# EAGLE design TFT Touch (EAGLE 5.11)
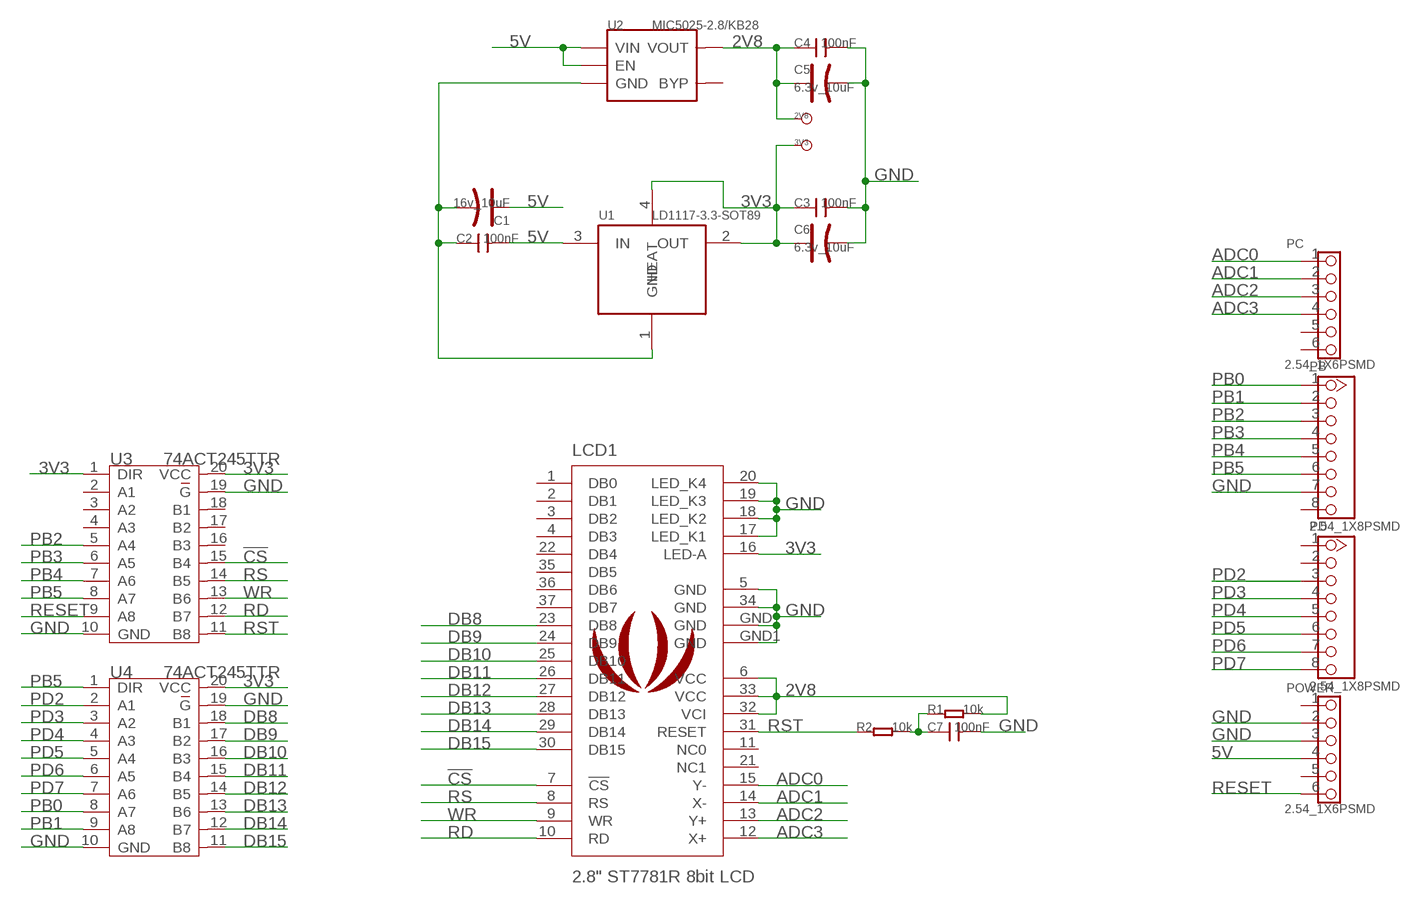
[diagram p0: schematic, sheet 1]

## Parts
2V8  TEST_POINT_SIZE_3030  [TP_3535]
3V3  TEST_POINT_SIZE_3030  [TP_3535]
C1  16v_10uF  006-CAP_AVX_A  [AVX_A]
C2  100nF  006-C35*40  [0603]
C3  100nF  006-C35*40  [0603]
C4  100nF  006-C35*40  [0603]
C5  6.3v_10uF  006-CAP_AVX_A  [AVX_A]
C6  6.3v_10uF  006-CAP_AVX_A  [AVX_A]
C7  100nF  006-C35*40  [0603]
LCD1  2.8" ST7781R 8bit LCD  TFT2.8  [TFT2.8]
LOGO1  LOGO_SILK  [LOGO_SILK]
PB  2.54_1X8PSMD  [SMD_8PIN_2.54]
PC  2.54_1X6PSMD  6PSMD  [2.54_6P_SMD]
PD  2.54_1X8PSMD  [SMD_8PIN_2.54]
POWER  2.54_1X6PSMD  6PSMD  [2.54_6P_SMD]
R1  10k  005-R0603  [0603-1]
R2  10k  005-R0603  [0603-1]
U1  LD1117-3.3-SOT89  LD1117SOT89  [SOT89]
U2  MIC5025-2.8/KB28  MIC5205  [SOT23-5]
U3  74ACT245TTR  74ACT245  [TSSOP20]
U4  74ACT245TTR  74ACT245  [TSSOP20]

## Nets
2V8: 2V8.T C4.1 C5.+ LCD1.6(VCC) LCD1.32(VCI) LCD1.33(VCC) R1.2 U2.5(VOUT)
3V3: 3V3.T C3.1 C6.+ LCD1.16(LED-A) U1.2(OUT) U1.4(HEAT) U3.1(DIR) U3.20(VCC) U4.20(VCC)
5V: C1.+ C2.2 POWER.4 U1.3(IN) U2.1(VIN) U2.3(EN)
!CS: LCD1.7(!CS) U3.15(B4)
ADC0: LCD1.15(Y-) PC.1
ADC1: LCD1.14(X-) PC.2
ADC2: LCD1.13(Y+) PC.3
ADC3: LCD1.12(X+) PC.4
DB8: LCD1.23(DB8) U4.18(B1)
DB9: LCD1.24(DB9) U4.17(B2)
DB10: LCD1.25(DB10) U4.16(B3)
DB11: LCD1.26(DB11) U4.15(B4)
DB12: LCD1.27(DB12) U4.14(B5)
DB13: LCD1.28(DB13) U4.13(B6)
DB14: LCD1.29(DB14) U4.12(B7)
DB15: LCD1.30(DB15) U4.11(B8)
GND: C1.- C2.1 C3.2 C4.2 C5.- C6.- C7.2 LCD1.5(GND) LCD1.17(LED_K1) LCD1.18(LED_K2) LCD1.19(LED_K3) LCD1.20(LED_K4) LCD1.34(GND) LCD1.GND LCD1.GND1(GND) PB.7 POWER.2 POWER.3 U1.1(GND) U2.2(GND) U3.10(GND) U3.19(G) U4.10(GND) U4.19(G)
N$1: C7.1 R1.1 R2.2
PB0: PB.1 U4.8(A7)
PB1: PB.2 U4.9(A8)
PB2: PB.3 U3.5(A4)
PB3: PB.4 U3.6(A5)
PB4: PB.5 U3.7(A6)
PB5: PB.6 U3.8(A7) U4.1(DIR)
PD2: PD.3 U4.2(A1)
PD3: PD.4 U4.3(A2)
PD4: PD.5 U4.4(A3)
PD5: PD.6 U4.5(A4)
PD6: PD.7 U4.6(A5)
PD7: PD.8 U4.7(A6)
RD: LCD1.10(RD) U3.12(B7)
RESET: POWER.6 U3.9(A8)
RS: LCD1.8(RS) U3.14(B5)
RST: LCD1.31(RESET) R2.1 U3.11(B8)
WR: LCD1.9(WR) U3.13(B6)
Unconnected: LCD1.1(DB0) LCD1.2(DB1) LCD1.3(DB2) LCD1.4(DB3) LCD1.11(NC0) LCD1.21(NC1) LCD1.22(DB4) LCD1.35(DB5) LCD1.36(DB6) LCD1.37(DB7) PB.8 PC.5 PC.6 PD.1 PD.2 POWER.1 POWER.5 U2.4(BYP) U3.2(A1) U3.3(A2) U3.4(A3) U3.16(B3) U3.17(B2) U3.18(B1)

## Library data of the parts
2V8 3V3 = For_Test_Albert:TEST_POINT
C1 C5 C6 = Discrete:006-CAP*: Electrolytic Capacitors,Tantalum Capacitors and Super Capacitors
C2-C4 C7 = Discrete:006-C*: Ceramic Capacitors
LCD1 = EXT_moudle:TFT2.8
LOGO1 = logo:LOGO_SILK
PB PD = Connector:2.54_1X8P
PC POWER = Connector:6P
R1 R2 = Discrete:005-R*
U1 = ICs_v54:LD1117
U2 = IC:MIC5205: The MIC5205 is an efficient linear voltage regulator with ultra-low-noise output, very low dropout voltage (typically 17mV at light loads and 165mV at 150mA), and very low ground current (600µA at 100mA output). The MIC5205 offers better than 1% initial accuracy. datasheet here: http://www.micrel.com/product-info/prod/5205.shtml
U3 U4 = IC:74ACT245

## Net classes
0 default: width 0.203 mm, drill 0.305 mm, clearance 0.152 mm

## Board
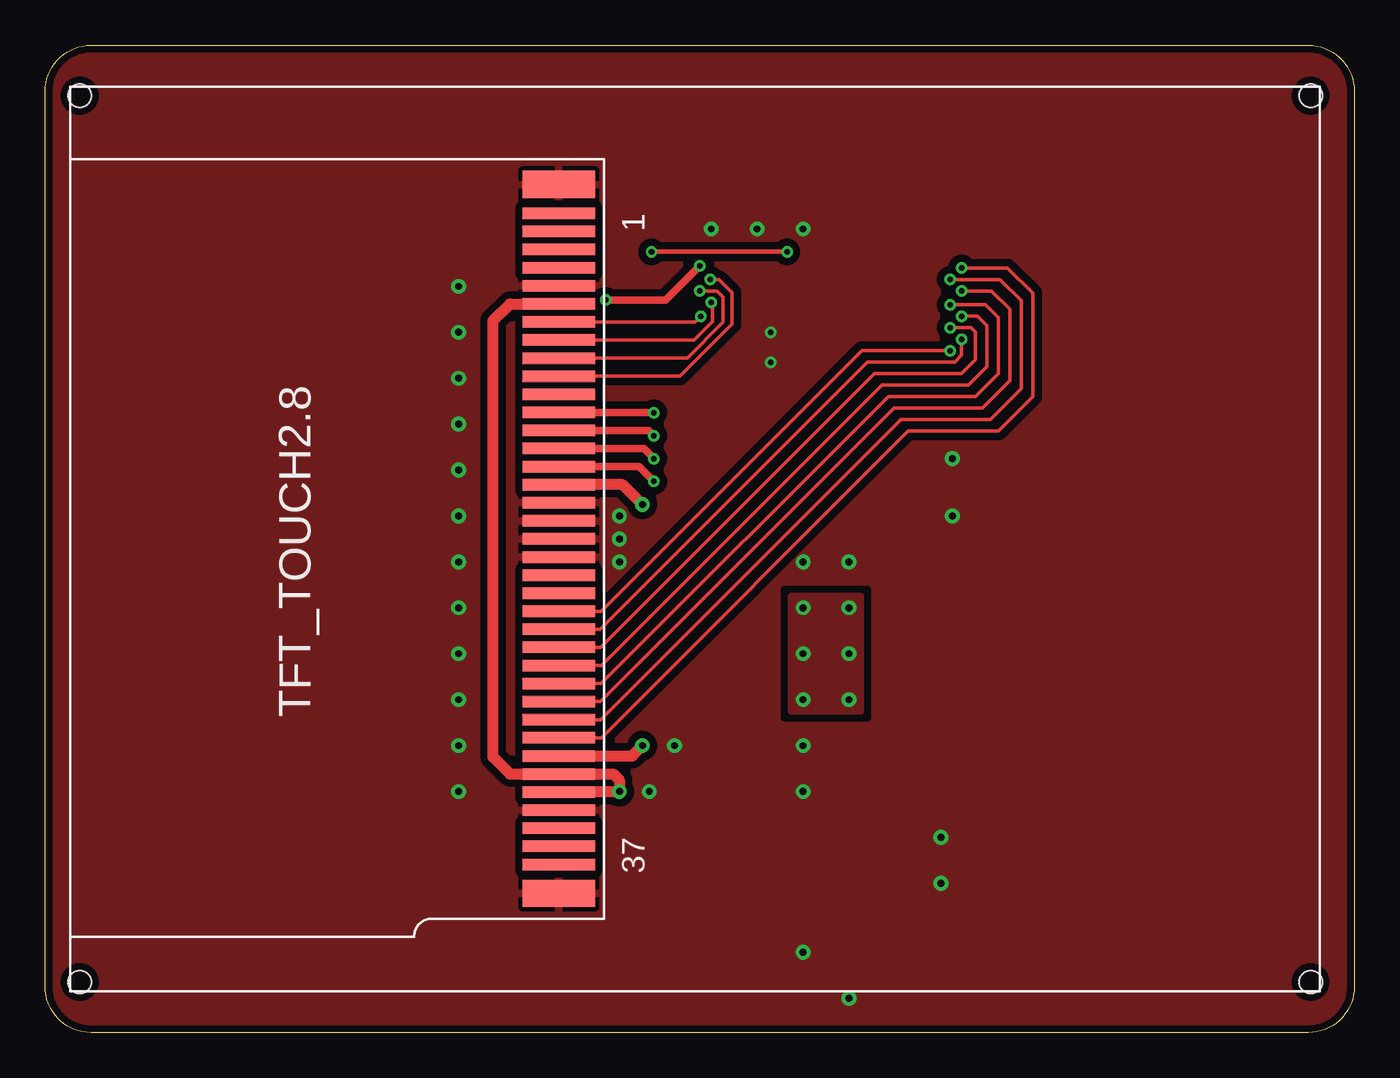
[diagram p1: board, top side]
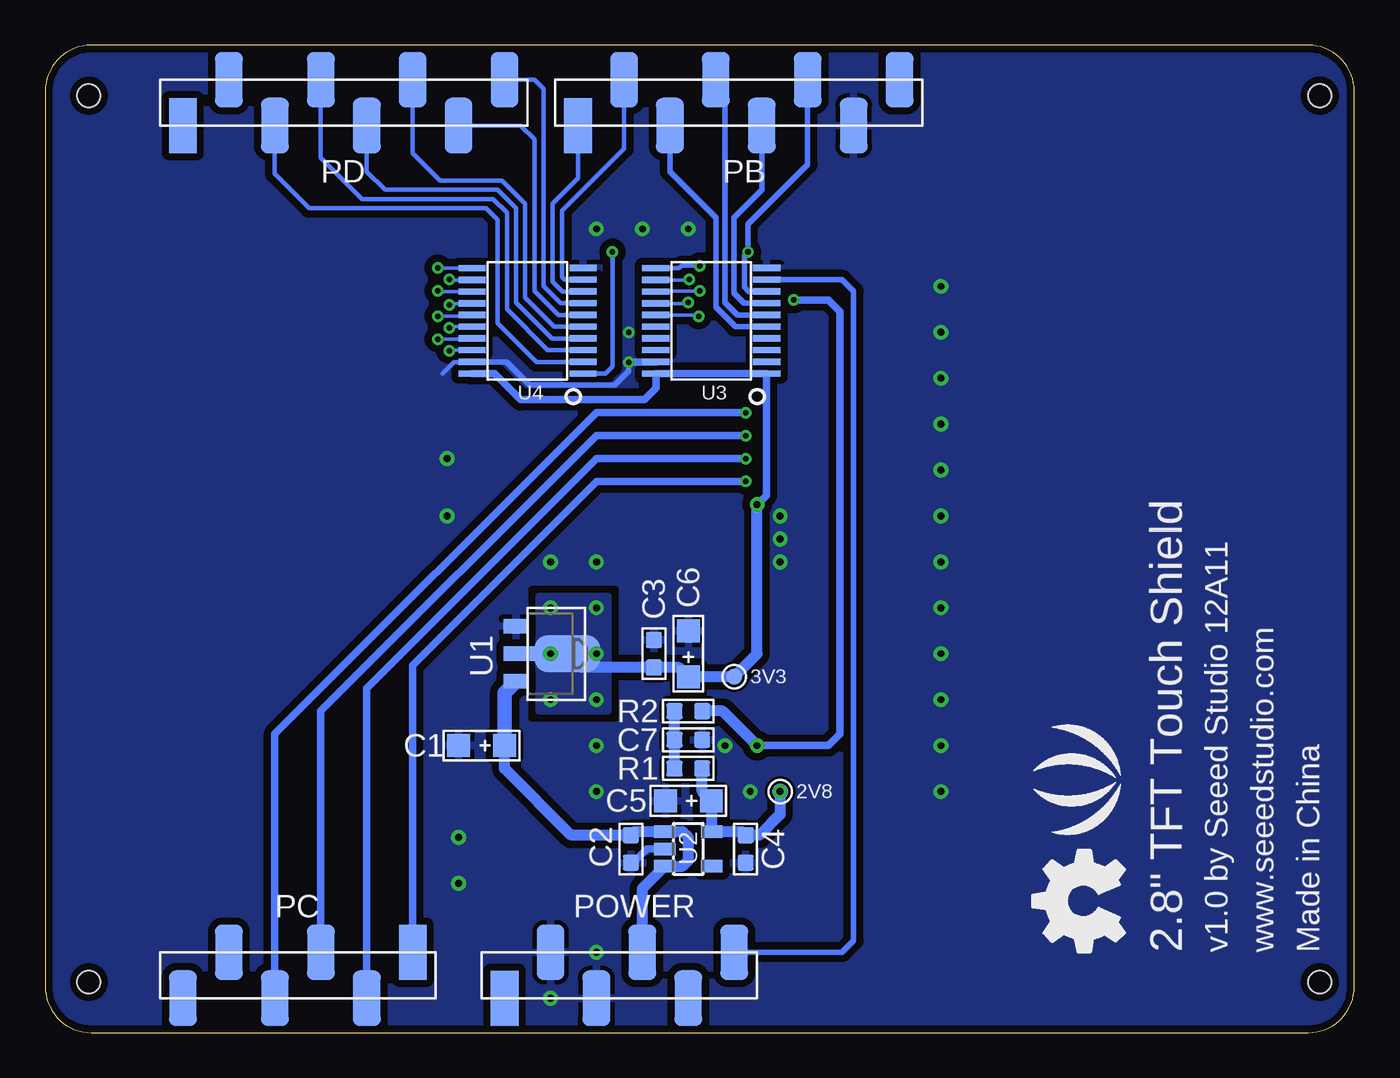
[diagram p2: board, bottom side, seen from below]

Size 72.39 x 54.61 mm. Coordinates in mm from the lower left corner, seen from the top.
Outline: 0,52.07 arc-90 2.54,54.61 69.85,54.61 arc-90 72.39,52.07 72.39,2.54 arc-90 69.85,0 2.54,0 arc-90 0,2.54 0,52.07
Copper layers (1*16): Top 0.035mm / dielectric 1.5mm / Bottom 0.035mm
Design rules "rule_manufacture *": minimum track width 8mil, minimum drill 12mil, track to track 6mil, track to pad 6mil, pad to pad 6mil, via to via 8mil, smd to smd 0mil, copper to edge 10mil, drill to drill 10mil, minimum pad ring 10mil, minimum via ring 6mil, stop-mask expansion 2mil, vias tented up to drill 25mil, thermal gap 10mil
tRestrict: area 27.4,26.2 to 29.3,29.3

### Footprints (pad centres in the part's own frame; a part is rotated, then mirrored left to right if it is on the bottom)
TP_3535 = smd 0.889 x 0.889: T 0,0
AVX_A = smd 1.27 x 1.27: + -1.27,0; - 1.27,0
0603 = smd 0.889 x 0.889: 1 -0.762,0; 2 0.762,0
TFT2.8 = smd 4 x 0.635: 1 27,43.019; 2 27,42.019; 3 27,41.019; 4 27,40.019; 5 27,39.019; 6 27,38.019; 7 27,37.019; 8 27,36.019; 9 27,35.019; 10 27,34.019; 11 27,33.019; 12 27,32.019; 13 27,31.019; 14 27,30.019; 15 27,29.019; 16 27,28.019; 17 27,27.019; 18 27,26.019; 19 27,25.019; 20 27,24.019; 21 27,23.019; 22 27,22.019; 23 27,21.019; 24 27,20.019; 25 27,19.019; 26 27,18.019; 27 27,17.019; 28 27,16.019; 29 27,15.019; 30 27,14.019; 31 27,13.019; 32 27,12.019; 33 27,11.019; 34 27,10.019; 35 27,9.019; 36 27,8.019; 37 27,7.019 | smd 4 x 1.516: GND 27,5.419; GND1 27,44.619 | hole 1.27: 0.508,49.53; 68.58,49.53; 68.58,0.508; 0.508,0.508
SMD_8PIN_2.54 = smd 3.048 x 1.524: 1 -1.27,8.89; 2 1.27,6.35; 3 -1.27,3.81; 4 1.27,1.27; 5 -1.27,-1.27; 6 1.27,-3.81; 7 -1.27,-6.35; 8 1.27,-8.89
2.54_6P_SMD = smd 3.048 x 1.524: 1 -1.27,6.35; 2 1.27,3.81; 3 -1.27,1.27; 4 1.27,-1.27; 5 -1.27,-3.81; 6 1.27,-6.35
0603-1 = smd 0.889 x 0.889: 1 -0.762,0; 2 0.762,0
SOT89 = smd 0.8 x 1.4: 1 -1.524,-1.905; 3 1.524,-1.905 | smd 0.8 x 1.9: 2 0,-1.651 | smd 2.032 x 3.65: 4 0,0.94
SOT23-5 = smd 0.69 x 1.2: 1 -0.95,-1.3; 2 0,-1.3; 3 0.95,-1.3; 4 0.95,1.3; 5 -0.95,1.3
TSSOP20 = smd 0.35 x 1.5: 1 -2.925,-3.065; 2 -2.275,-3.065; 3 -1.625,-3.065; 4 -0.975,-3.065; 5 -0.325,-3.065; 6 0.325,-3.065; 7 0.975,-3.065; 8 1.625,-3.065; 9 2.275,-3.065; 10 2.925,-3.065; 11 2.91,3.065; 12 2.26,3.065; 13 1.61,3.065; 14 0.96,3.065; 15 0.325,3.065; 16 -0.325,3.065; 17 -0.975,3.065; 18 -1.625,3.065; 19 -2.275,3.065; 20 -2.925,3.065

### Placement (x,y rotation side)
2V8  31.75,13.33 0 bottom
3V3  34.29,19.69 0 bottom
C1  48.26,15.88 180 bottom
C2  40.01,10.16 90 bottom
C3  38.73,20.96 90 bottom
C4  33.66,10.16 270 bottom
C5  36.83,12.83 180 bottom
C6  36.83,20.96 90 bottom
C7  36.83,16.19 0 bottom
LCD1  1.4,2.29 0 top
LOGO1  14.61,13.97 90 bottom
PB  34.04,51.43 90 bottom
PC  58.42,3.17 270 bottom
PD  55.88,51.43 90 bottom
POWER  40.64,3.17 90 bottom
R1  36.83,14.61 0 bottom
R2  36.83,17.78 180 bottom
U1  44.45,20.96 270 bottom
U2  36.83,10.16 270 bottom
U3  35.56,39.37 90 bottom
U4  45.72,39.37 90 bottom
U$1  [OSHW_FILLX200_NOTEXT]  12.7,4.45 90 bottom

### Tracks (layer width: path | path; a pad name or v marks a point on that pad's centre or on a via)
2V8  (via drill 0.38 pad 0.81)
  Top 0.61: LCD1.33 31.72,13.3 2V8.T 31.75,13.97 31.41,14.3 LCD1.32 25.7,14.3 24.77,15.24 24.77,39.37 25.7,40.3 LCD1.6
  Bottom 0.61: 2V8.T 31.75,12.06 32.89,10.92 C4.1 33.84,11.11 U2.5 35.53,12.8 C5.+ 36.07,13.33 R1.2
  other vias: 31.75,13.33
3V3  (via drill 0.38 pad 0.81)
  Top 0.61: LCD1.16 31.93,30.31 v33.02,29.21
  Bottom 0.406: v33.02,29.21 32.51,29.72 32.51,36.43 U3.1 U3.20 38.61,36.43 38.61,35.65 39.24,35.01 46.1,35.01 47.53,36.45 U4.20
  Bottom 0.61: U1.2 v44.45,20.96 U1.4 42.75,20.19 C3.1 37.34,20.19 C6.+ 3V3.T 33.02,20.96 v33.02,29.21
  other vias: 44.45,23.5 41.91,23.5 41.91,20.96 41.91,18.42 44.45,18.42
  pour Bottom (isolate 0.406, no thermals): 41.27,17.78 41.27,24.13 45.09,24.13 45.09,17.78
  pour Top (isolate 0.406): 41.27,17.78 41.27,24.13 45.09,24.13 45.09,17.78
5V
  Bottom 0.61: POWER.4 39.37,7.97 U2.3 37.15,9.21 36.83,9.53 36.83,10.79 37.15,11.11 U2.1 39.82,11.11 C2.2 43.31,10.92 46.99,14.61 C1.+
  Bottom 0.813: C1.+ 46.99,18.8 U1.3
!CS  (via drill 0.3 pad 0.64)
  Top 0.203: LCD1.7 35.94,39.3 v36.26,39.62
  Bottom 0.203: U3.15 36.33,39.7 v36.26,39.62
ADC0  (via drill 0.3 pad 0.64)
  Top 0.406: LCD1.15 32.83,31.31 v33.66,30.48
  Bottom 0.406: PC.1 52.07,20.32 41.91,30.48 v33.66,30.48
ADC1  (via drill 0.3 pad 0.64)
  Top 0.406: LCD1.14 33.1,32.3 v33.66,31.75
  Bottom 0.406: PC.2 54.61,19.05 41.91,31.75 v33.66,31.75
ADC2  (via drill 0.3 pad 0.64)
  Top 0.406: LCD1.13 33.37,33.3 v33.66,33.02
  Bottom 0.406: PC.3 57.15,17.78 41.91,33.02 v33.66,33.02
ADC3  (via drill 0.3 pad 0.64)
  Top 0.406: LCD1.12 33.64,34.3 v33.66,34.29
  Bottom 0.406: PC.4 59.69,16.51 41.91,34.29 v33.66,34.29
DB8  (via drill 0.3 pad 0.64)
  Top 0.203: LCD1.23 30.74,23.31 45.15,37.72 v50.04,37.72
  Bottom 0.203: U4.18 50.01,37.74 v50.04,37.72
DB9  (via drill 0.3 pad 0.64)
  Top 0.203: LCD1.24 30.69,22.31 45.47,37.08 50.29,37.08 50.67,37.46 v50.67,38.35
  Bottom 0.203: v50.67,38.35 48.83,38.35 U4.17
DB10  (via drill 0.3 pad 0.64)
  Top 0.203: LCD1.25 30.71,21.31 45.85,36.45 50.67,36.45 51.44,37.21 51.44,38.73 51.18,38.99 v50.04,38.99
  Bottom 0.203: U4.16 49.98,39.04 v50.04,38.99
DB11  (via drill 0.3 pad 0.64)
  Top 0.203: LCD1.26 30.76,20.31 46.27,35.81 51.05,35.81 52.07,36.83 52.07,39.12 51.56,39.62 v50.67,39.62
  Bottom 0.203: v50.67,39.62 48.86,39.62 U4.15
DB12  (via drill 0.3 pad 0.64)
  Top 0.203: LCD1.27 30.74,19.31 46.62,35.18 51.44,35.18 52.7,36.45 52.7,39.54 51.99,40.26 v50.04,40.26
  Bottom 0.203: U4.14 49.97,40.33 v50.04,40.26
DB13  (via drill 0.3 pad 0.64)
  Top 0.203: LCD1.28 30.7,18.31 46.93,34.54 51.82,34.54 53.34,36.07 53.34,40 52.32,41.02 v50.67,41.02
  Bottom 0.203: U4.13 50.63,40.98 v50.67,41.02
DB14  (via drill 0.3 pad 0.64)
  Top 0.203: LCD1.29 30.71,17.31 47.32,33.91 52.27,33.91 53.98,35.62 53.98,40.48 52.8,41.66 v50.04,41.66
  Bottom 0.203: U4.12 50.01,41.63 v50.04,41.66
DB15  (via drill 0.3 pad 0.64)
  Top 0.203: LCD1.30 30.75,16.3 47.72,33.27 52.7,33.27 54.61,35.18 54.61,40.89 53.21,42.29 v50.67,42.29
  Bottom 0.203: U4.11 50.66,42.28 v50.67,42.29
GND  (via drill 0.3 pad 0.64, 0.38 pad 0.81)
  Bottom 0.254: U4.19 49.77,37.09 50.42,36.45
  Bottom 0.305: U4.19 46.87,37.09 45.59,35.81 40.89,35.81 40.13,36.58 v40.13,37.08
  Bottom 0.406: U2.2 39.12,10.16 39.88,9.4 C2.1 | U3.19 v40.12,37.09 v40.13,37.08
  other vias: 41.91,26.04 44.45,26.04 31.75,26.04 31.75,28.58 31.75,27.31 41.91,15.88 49.53,8.26 49.53,10.79 44.45,1.91 41.91,4.45 41.91,13.33 22.86,15.88 22.86,18.42 22.86,20.96 22.86,23.5 22.86,26.04 22.86,28.58 22.86,31.12 22.86,33.66 22.86,36.2 22.86,38.73 22.86,41.27 22.86,13.33 36.83,44.45 41.91,44.45 50.16,31.75 50.16,28.58 34.8,15.88 33.4,13.33 39.37,44.45 40.13,38.73
  pour Top: -6.35,53.98 -5.08,53.98 -5.08,52.7 -6.35,52.7
  pour Bottom (isolate 0.406, rank 6): 0,54.61 72.39,54.61 72.39,0 0,0
  pour Top (isolate 0.406, rank 6): 0,54.61 72.39,54.61 72.39,0 0,0
N$1
  Bottom 0.61: R1.1 C7.1 R2.2
PB0
  Bottom 0.254: U4.8 43.79,40.99 44.32,41.53 44.32,45.85 42.93,47.24 PB.1
PB1
  Bottom 0.254: U4.9 43.68,41.64 43.81,41.78 43.81,45.47 40.39,48.89 PB.2
PB2
  Bottom 0.305: U3.5 34.22,39.04 35.31,40.13 35.31,45.09 37.85,47.62 PB.3
PB3
  Bottom 0.305: U3.6 34.11,39.7 34.8,40.39 34.8,52.2 PB.4
PB4
  Bottom 0.305: U3.7 33.74,40.34 34.29,40.89 34.29,45.09 32.77,46.61 PB.5
PB5  (via drill 0.3 pad 0.64)
  Top 0.254: v33.53,43.18 v41.02,43.18
  Bottom 0.254: U4.1 41.41,36.45 41.02,36.83 v41.02,43.18
  Bottom 0.305: U3.8 33.5,40.99 33.73,41.22 33.73,42.98 v33.53,43.18 33.53,44.7 30.23,48.01 PB.6
PD2
  Bottom 0.254: U4.2 45.22,37.09 47.37,39.24 47.37,44.96 48.01,45.59 57.78,45.59 59.69,47.5 PD.3
PD3
  Bottom 0.254: U4.3 44.6,37.74 46.86,40 46.86,45.34 47.62,46.1 54.86,46.1 57.15,48.39 PD.4
PD4
  Bottom 0.254: U4.4 44.36,38.39 46.35,40.39 46.35,45.59 47.37,46.61 53.59,46.61 54.61,47.62 PD.5
PD5
  Bottom 0.254: U4.5 44.25,39.04 45.85,40.64 45.85,45.85 47.12,47.12 50.55,47.12 52.07,48.64 PD.6
PD6
  Bottom 0.254: U4.6 44.01,39.7 45.34,41.02 45.34,49.4 46.1,50.16 PD.7
PD7
  Bottom 0.254: U4.7 43.9,40.34 44.83,41.27 44.83,52.2 45.34,52.7 PD.8
RD  (via drill 0.3 pad 0.64)
  Top 0.203: LCD1.10 35.11,36.3 37.99,39.18 37.99,40.92 37.26,41.66 v36.77,41.66
  Bottom 0.203: U3.12 36.79,41.63 v36.77,41.66
RESET
  Bottom 0.305: U3.9 28.32,41.64 27.69,41.01 27.69,5.08 28.32,4.45 POWER.6
RS  (via drill 0.3 pad 0.64)
  Top 0.203: LCD1.8 35.88,38.3 36.9,39.33 36.9,40.31 v36.83,40.39
  Bottom 0.203: U3.14 36.89,40.33 v36.83,40.39
RST  (via drill 0.3 pad 0.64, 0.38 pad 0.81)
  Top 0.406: v30.99,40.51 34.29,40.51 v36.2,42.42
  Top 0.61: LCD1.31 32.45,15.3 v33.02,15.88
  Bottom 0.254: v36.2,42.42 37.21,42.42 37.34,42.29 38.61,42.29 U3.11
  Bottom 0.406: v30.99,40.51 29.08,40.51 28.45,39.88 28.45,16.51 29.08,15.88 v33.02,15.88
  Bottom 0.61: R2.1 34.92,17.78 v33.02,15.88
WR  (via drill 0.3 pad 0.64)
  Top 0.203: LCD1.9 35.51,37.3 37.49,39.29 37.49,40.67 37.14,41.02 v36.2,41.02
  Bottom 0.203: v36.2,41.02 38.58,41.02 U3.13

### Text on the board
bPlace: Made in China | www.seeedstudio.com | v1.0 by Seeed Studio 12A11 | 2.8" TFT Touch Shield